# Altium schematic sheet ADC.SchDoc
size A4
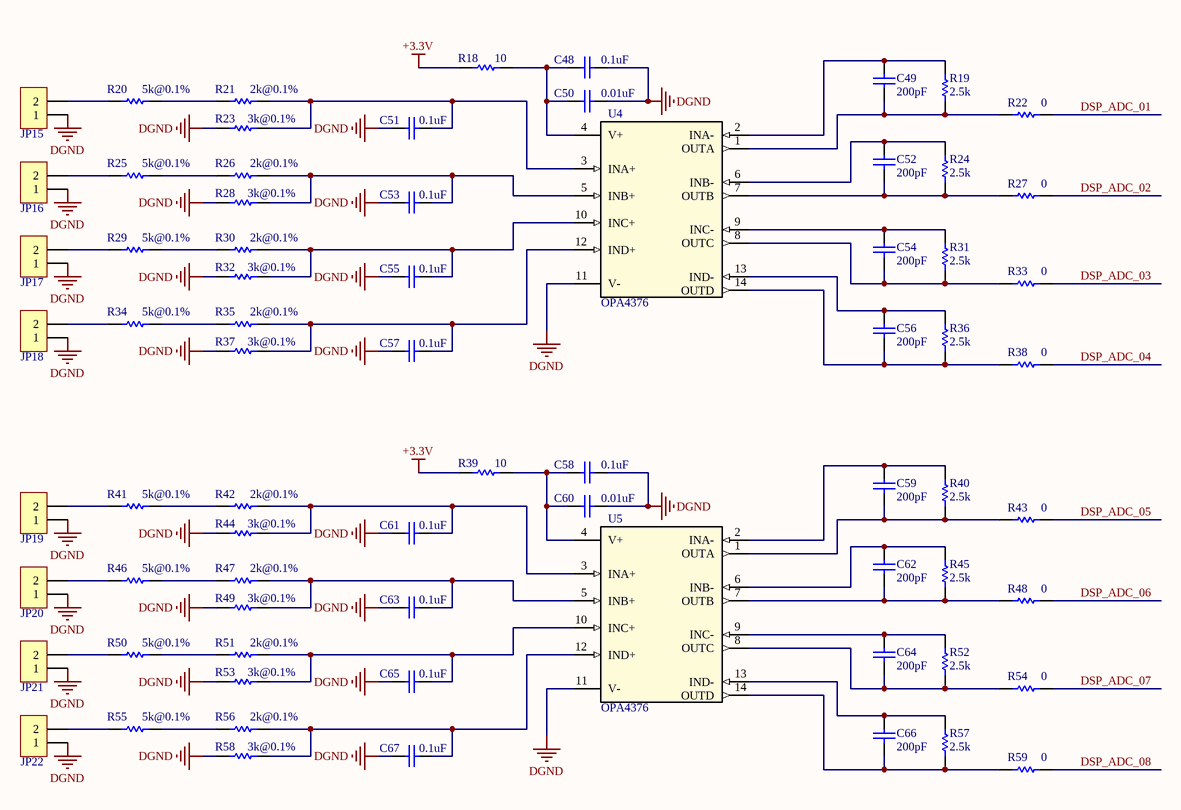
[diagram p0: ADC.SchDoc]

## Parts
C48  value 0.1uF  [1608[0603]]  (hidden comment: Cap)
C49  value 200pF  [1608[0603]]  (hidden comment: Cap)
C50  value 0.01uF  [1608[0603]]  (hidden comment: Cap)
C51  value 0.1uF  [1608[0603]]  (hidden comment: Cap)
C52  value 200pF  [1608[0603]]  (hidden comment: Cap)
C53  value 0.1uF  [1608[0603]]  (hidden comment: Cap)
C54  value 200pF  [1608[0603]]  (hidden comment: Cap)
C55  value 0.1uF  [1608[0603]]  (hidden comment: Cap)
C56  value 200pF  [1608[0603]]  (hidden comment: Cap)
C57  value 0.1uF  [1608[0603]]  (hidden comment: Cap)
C58  value 0.1uF  [1608[0603]]  (hidden comment: Cap)
C59  value 200pF  [1608[0603]]  (hidden comment: Cap)
C60  value 0.01uF  [1608[0603]]  (hidden comment: Cap)
C61  value 0.1uF  [1608[0603]]  (hidden comment: Cap)
C62  value 200pF  [1608[0603]]  (hidden comment: Cap)
C63  value 0.1uF  [1608[0603]]  (hidden comment: Cap)
C64  value 200pF  [1608[0603]]  (hidden comment: Cap)
C65  value 0.1uF  [1608[0603]]  (hidden comment: Cap)
C66  value 200pF  [1608[0603]]  (hidden comment: Cap)
C67  value 0.1uF  [1608[0603]]  (hidden comment: Cap)
JP15  HDR-1X2  [MX 1.25-WI-2P]  (value not drawn)
JP16  HDR-1X2  [MX 1.25-WI-2P]  (value not drawn)
JP17  HDR-1X2  [MX 1.25-WI-2P]  (value not drawn)
JP18  HDR-1X2  [MX 1.25-WI-2P]  (value not drawn)
JP19  HDR-1X2  [MX 1.25-WI-2P]  (value not drawn)
JP20  HDR-1X2  [MX 1.25-WI-2P]  (value not drawn)
JP21  HDR-1X2  [MX 1.25-WI-2P]  (value not drawn)
JP22  HDR-1X2  [MX 1.25-WI-2P]  (value not drawn)
R18  value 10  [1608[0603]]  (hidden comment: Res1)
R19  value 2.5k  [1608[0603]]  (hidden comment: Res1)
R20  value 5k@0.1%  [1608[0603]]  (hidden comment: Res1)
R21  value 2k@0.1%  [1608[0603]]  (hidden comment: Res1)
R22  value 0  [1608[0603]]  (hidden comment: Res1)
R23  value 3k@0.1%  [1608[0603]]  (hidden comment: Res1)
R24  value 2.5k  [1608[0603]]  (hidden comment: Res1)
R25  value 5k@0.1%  [1608[0603]]  (hidden comment: Res1)
R26  value 2k@0.1%  [1608[0603]]  (hidden comment: Res1)
R27  value 0  [1608[0603]]  (hidden comment: Res1)
R28  value 3k@0.1%  [1608[0603]]  (hidden comment: Res1)
R29  value 5k@0.1%  [1608[0603]]  (hidden comment: Res1)
R30  value 2k@0.1%  [1608[0603]]  (hidden comment: Res1)
R31  value 2.5k  [1608[0603]]  (hidden comment: Res1)
R32  value 3k@0.1%  [1608[0603]]  (hidden comment: Res1)
R33  value 0  [1608[0603]]  (hidden comment: Res1)
R34  value 5k@0.1%  [1608[0603]]  (hidden comment: Res1)
R35  value 2k@0.1%  [1608[0603]]  (hidden comment: Res1)
R36  value 2.5k  [1608[0603]]  (hidden comment: Res1)
R37  value 3k@0.1%  [1608[0603]]  (hidden comment: Res1)
R38  value 0  [1608[0603]]  (hidden comment: Res1)
R39  value 10  [1608[0603]]  (hidden comment: Res1)
R40  value 2.5k  [1608[0603]]  (hidden comment: Res1)
R41  value 5k@0.1%  [1608[0603]]  (hidden comment: Res1)
R42  value 2k@0.1%  [1608[0603]]  (hidden comment: Res1)
R43  value 0  [1608[0603]]  (hidden comment: Res1)
R44  value 3k@0.1%  [1608[0603]]  (hidden comment: Res1)
R45  value 2.5k  [1608[0603]]  (hidden comment: Res1)
R46  value 5k@0.1%  [1608[0603]]  (hidden comment: Res1)
R47  value 2k@0.1%  [1608[0603]]  (hidden comment: Res1)
R48  value 0  [1608[0603]]  (hidden comment: Res1)
R49  value 3k@0.1%  [1608[0603]]  (hidden comment: Res1)
R50  value 5k@0.1%  [1608[0603]]  (hidden comment: Res1)
R51  value 2k@0.1%  [1608[0603]]  (hidden comment: Res1)
R52  value 2.5k  [1608[0603]]  (hidden comment: Res1)
R53  value 3k@0.1%  [1608[0603]]  (hidden comment: Res1)
R54  value 0  [1608[0603]]  (hidden comment: Res1)
R55  value 5k@0.1%  [1608[0603]]  (hidden comment: Res1)
R56  value 2k@0.1%  [1608[0603]]  (hidden comment: Res1)
R57  value 2.5k  [1608[0603]]  (hidden comment: Res1)
R58  value 3k@0.1%  [1608[0603]]  (hidden comment: Res1)
R59  value 0  [1608[0603]]  (hidden comment: Res1)
U4  OPA4376  [OPA4376_TSSOP]
U5  OPA4376  [OPA4376_TSSOP]

## Nets
+3.3V: R18.2 R39.2
DGND: C48.2 C50.2 C51.1 C53.1 C55.1 C57.1 C58.2 C60.2 C61.1 C63.1 C65.1 C67.1 JP15.1 JP16.1 JP17.1 JP18.1 JP19.1 JP20.1 JP21.1 JP22.1 R23.2 R28.2 R32.2 R37.2 R44.2 R49.2 R53.2 R58.2 U4.11(V-) U5.11(V-)
DSP_ADC_01: R22.2
DSP_ADC_02: R27.2
DSP_ADC_03: R33.2
DSP_ADC_04: R38.2
DSP_ADC_05: R43.2
DSP_ADC_06: R48.2
DSP_ADC_07: R54.2
DSP_ADC_08: R59.2
NetC48_1: C48.1 C50.1 R18.1 U4.4(V+)
NetC49_1: C49.1 R19.2 U4.2(INA-)
NetC49_2: C49.2 R19.1 R22.1 U4.1(OUTA)
NetC51_2: C51.2 R21.1 R23.1 U4.3(INA+)
NetC52_1: C52.1 R24.2 U4.6(INB-)
NetC52_2: C52.2 R24.1 R27.1 U4.7(OUTB)
NetC53_2: C53.2 R26.1 R28.1 U4.5(INB+)
NetC54_1: C54.1 R31.2 U4.9(INC-)
NetC54_2: C54.2 R31.1 R33.1 U4.8(OUTC)
NetC55_2: C55.2 R30.1 R32.1 U4.10(INC+)
NetC56_1: C56.1 R36.2 U4.13(IND-)
NetC56_2: C56.2 R36.1 R38.1 U4.14(OUTD)
NetC57_2: C57.2 R35.1 R37.1 U4.12(IND+)
NetC58_1: C58.1 C60.1 R39.1 U5.4(V+)
NetC59_1: C59.1 R40.2 U5.2(INA-)
NetC59_2: C59.2 R40.1 R43.1 U5.1(OUTA)
NetC61_2: C61.2 R42.1 R44.1 U5.3(INA+)
NetC62_1: C62.1 R45.2 U5.6(INB-)
NetC62_2: C62.2 R45.1 R48.1 U5.7(OUTB)
NetC63_2: C63.2 R47.1 R49.1 U5.5(INB+)
NetC64_1: C64.1 R52.2 U5.9(INC-)
NetC64_2: C64.2 R52.1 R54.1 U5.8(OUTC)
NetC65_2: C65.2 R51.1 R53.1 U5.10(INC+)
NetC66_1: C66.1 R57.2 U5.13(IND-)
NetC66_2: C66.2 R57.1 R59.1 U5.14(OUTD)
NetC67_2: C67.2 R56.1 R58.1 U5.12(IND+)
NetJP15_2: JP15.2 R20.2
NetJP16_2: JP16.2 R25.2
NetJP17_2: JP17.2 R29.2
NetJP18_2: JP18.2 R34.2
NetJP19_2: JP19.2 R41.2
NetJP20_2: JP20.2 R46.2
NetJP21_2: JP21.2 R50.2
NetJP22_2: JP22.2 R55.2
NetR20_1: R20.1 R21.2
NetR25_1: R25.1 R26.2
NetR29_1: R29.1 R30.2
NetR34_1: R34.1 R35.2
NetR41_1: R41.1 R42.2
NetR46_1: R46.1 R47.2
NetR50_1: R50.1 R51.2
NetR55_1: R55.1 R56.2

## Library data of the parts
C48-C67 = Cap: Capacitor; Published: 8-Jun-2000; LatestRevisionDate: 17-Jul-2002; LatestRevisionNote: Re-released for DXP Platform.; PackageReference: RAD-0.3; Publisher: Altium Limited; PackageDescription: Radial Cap, Thru-Hole; 2 Leads; 0.3 in Pin Spacing
JP15-JP22 = Header 2: 2P接插件; 版权归属: 源创客; BOM名称: 2P接插件; 学习资源: www.ooocke.com
R18-R59 = Res1: Resistor; Published: 8-Jun-2000; LatestRevisionDate: 17-Jul-2002; LatestRevisionNote: Re-released for DXP Platform.; PackageReference: AXIAL-0.3; Publisher: Altium Limited; PackageDescription: Axial Device, Thru-Hole; 2 Leads; 0.3 in Pin Spacing
U4 U5 = OPA4376: Manufacturer: Texas Instruments; Manufacturer_Part_Number: opa4376_pw_14; INDUSTRY_STD_PKG_TYPE: TSSOP; FAMILY_NAME: LOW OFFSET VOLTAGE; PIN_COUNT: 14; PACKAGE_DESIGNATOR: PW; Datasheet_URL: http://www.ti.com/lit/gpn/OPA4376; GENERIC_PART_NUMBER: OPA4376; Vendor: Texas Instruments; Value: Value; Type: Type; RefDes: RefDes